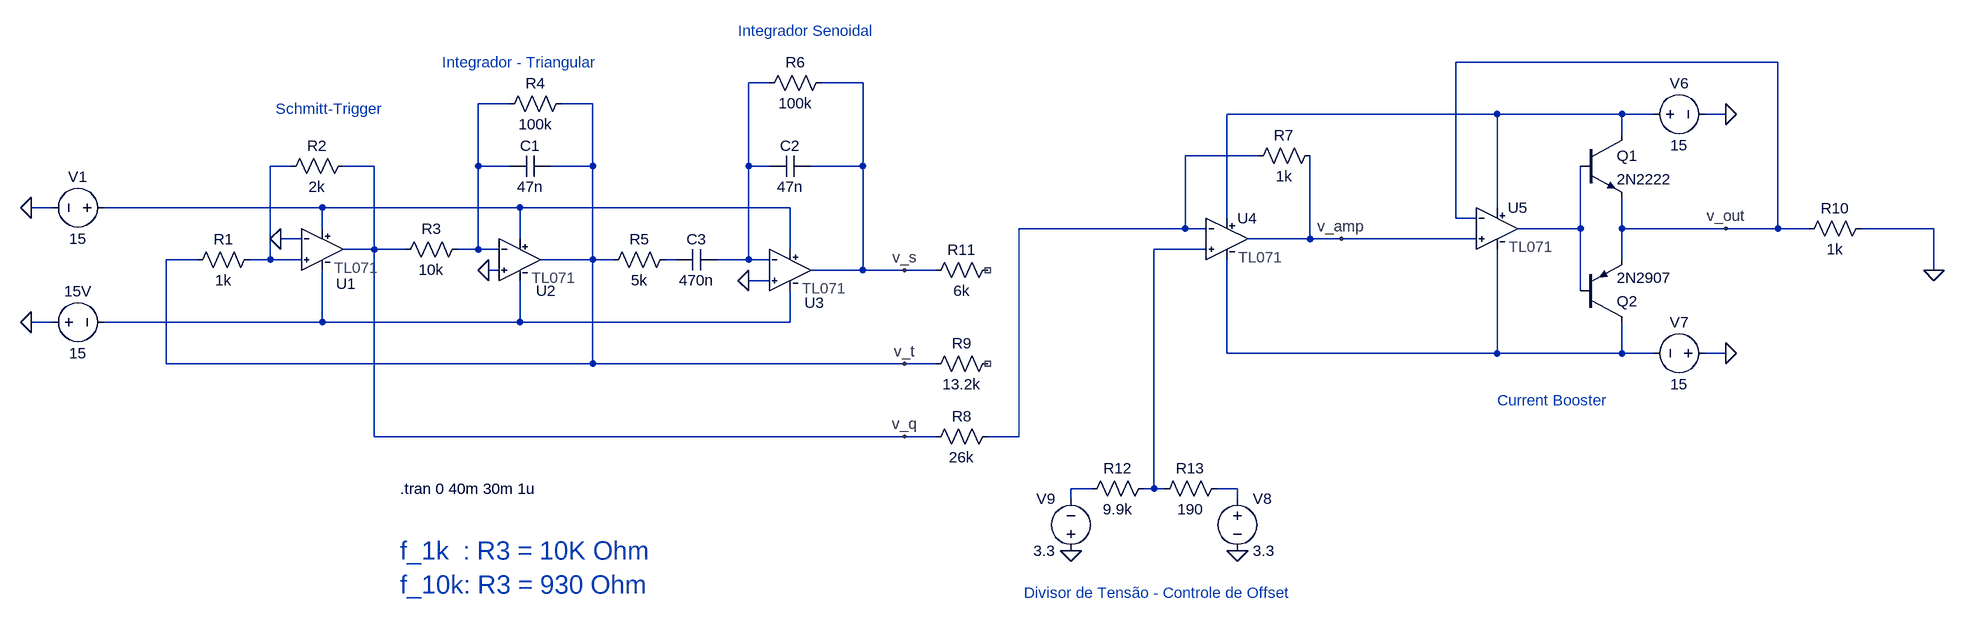
[diagram p0: schematic gerador_de_funcoes.asc]
gerador_de_funcoes.asc, the LTspice schematic file:
Version 4.1
SHEET 1 2532 720
WIRE 2048 -112 1552 -112
WIRE 496 -80 464 -80
WIRE 640 -80 576 -80
WIRE 96 -48 48 -48
WIRE 224 -48 176 -48
WIRE 1616 -32 1200 -32
WIRE 1808 -32 1616 -32
WIRE 1856 -32 1808 -32
WIRE 1968 -32 1936 -32
WIRE 1808 0 1808 -32
WIRE 1248 32 1136 32
WIRE -240 48 -272 48
WIRE -112 48 -160 48
WIRE 48 48 48 -48
WIRE 96 48 48 48
WIRE 224 48 224 -48
WIRE 224 48 160 48
WIRE 464 48 464 -80
WIRE 496 48 464 48
WIRE 640 48 640 -80
WIRE 640 48 560 48
WIRE -608 112 -640 112
WIRE -192 112 -528 112
WIRE 112 112 -192 112
WIRE 528 112 112 112
WIRE 1616 112 1616 -32
WIRE 1200 128 1200 -32
WIRE 1552 128 1552 -112
WIRE 1584 128 1552 128
WIRE -192 144 -192 112
WIRE 1136 144 1136 32
WIRE 1136 144 880 144
WIRE 1168 144 1136 144
WIRE 1744 144 1744 48
WIRE 1744 144 1648 144
WIRE 1808 144 1808 96
WIRE 1968 144 1808 144
WIRE 2048 144 2048 -112
WIRE 2048 144 1968 144
WIRE 2096 144 2048 144
WIRE 2288 144 2176 144
WIRE -224 160 -256 160
WIRE 112 160 112 112
WIRE 1328 160 1328 32
WIRE 1328 160 1232 160
WIRE 1376 160 1328 160
WIRE 1584 160 1376 160
WIRE -112 176 -112 48
WIRE -112 176 -160 176
WIRE -64 176 -112 176
WIRE 48 176 48 48
WIRE 48 176 16 176
WIRE 80 176 48 176
WIRE 528 176 528 112
WIRE 1168 176 1088 176
WIRE -384 192 -432 192
WIRE -272 192 -272 48
WIRE -272 192 -304 192
WIRE -224 192 -272 192
WIRE 224 192 224 48
WIRE 224 192 144 192
WIRE 256 192 224 192
WIRE 352 192 336 192
WIRE 464 192 464 48
WIRE 464 192 416 192
WIRE 496 192 464 192
WIRE 1808 192 1808 144
WIRE 80 208 64 208
WIRE 640 208 640 48
WIRE 640 208 560 208
WIRE 704 208 640 208
WIRE 752 208 704 208
WIRE 2288 208 2288 144
WIRE 496 224 464 224
WIRE 1744 240 1744 144
WIRE -608 288 -640 288
WIRE -192 288 -192 208
WIRE -192 288 -528 288
WIRE 112 288 112 224
WIRE 112 288 -192 288
WIRE 528 288 528 240
WIRE 528 288 112 288
WIRE 1200 336 1200 192
WIRE 1616 336 1616 176
WIRE 1616 336 1200 336
WIRE 1808 336 1808 288
WIRE 1808 336 1616 336
WIRE 1856 336 1808 336
WIRE 1968 336 1936 336
WIRE -432 352 -432 192
WIRE 224 352 224 192
WIRE 224 352 -432 352
WIRE 704 352 224 352
WIRE 752 352 704 352
WIRE -112 464 -112 176
WIRE 704 464 -112 464
WIRE 752 464 704 464
WIRE 880 464 880 144
WIRE 880 464 832 464
WIRE 992 544 960 544
WIRE 1088 544 1088 176
WIRE 1088 544 1072 544
WIRE 1104 544 1088 544
WIRE 1216 544 1184 544
WIRE 960 560 960 544
WIRE 1216 560 1216 544
FLAG -256 160 0
FLAG 464 224 0
FLAG 64 208 0
FLAG -640 288 0
FLAG -640 112 0
FLAG 704 352 v_t
FLAG 704 208 v_s
FLAG 704 464 v_q
FLAG 1376 160 v_amp
FLAG 2288 208 0
FLAG 1216 640 0
FLAG 960 640 0
FLAG 1968 144 v_out
FLAG 1968 336 0
FLAG 1968 -32 0
SYMBOL TL071 -192 176 R0
WINDOW 0 21 53 Left 2
SYMATTR InstName U1
SYMBOL res -144 32 R90
WINDOW 0 0 56 VBottom 2
WINDOW 3 32 56 VTop 2
SYMATTR InstName R2
SYMATTR Value 2k
SYMBOL res 32 160 R90
WINDOW 0 0 56 VBottom 2
WINDOW 3 32 56 VTop 2
SYMATTR InstName R3
SYMATTR Value 10k
SYMBOL res -288 176 R90
WINDOW 0 0 56 VBottom 2
WINDOW 3 32 56 VTop 2
SYMATTR InstName R1
SYMATTR Value 1k
SYMBOL TL071 112 192 R0
WINDOW 0 25 48 Left 2
SYMATTR InstName U2
SYMBOL res 192 -64 R90
WINDOW 0 0 56 VBottom 2
WINDOW 3 32 56 VTop 2
SYMATTR InstName R4
SYMATTR Value 100k
SYMBOL res 352 176 R90
WINDOW 0 0 56 VBottom 2
WINDOW 3 32 56 VTop 2
SYMATTR InstName R5
SYMATTR Value 5k
SYMBOL TL071 528 208 R0
WINDOW 0 22 50 Left 2
SYMATTR InstName U3
SYMBOL cap 560 32 R90
WINDOW 0 0 32 VBottom 2
WINDOW 3 32 32 VTop 2
SYMATTR InstName C2
SYMATTR Value 47n
SYMBOL res 592 -96 R90
WINDOW 0 0 56 VBottom 2
WINDOW 3 32 56 VTop 2
SYMATTR InstName R6
SYMATTR Value 100k
SYMBOL cap 160 32 R90
WINDOW 0 0 32 VBottom 2
WINDOW 3 32 32 VTop 2
SYMATTR InstName C1
SYMATTR Value 47n
SYMBOL voltage -512 112 R90
WINDOW 0 -32 56 VBottom 2
WINDOW 3 32 56 VTop 2
WINDOW 123 0 0 Left 0
WINDOW 39 0 0 Left 0
SYMATTR InstName V1
SYMATTR Value 15
SYMBOL voltage -624 288 R270
WINDOW 0 -32 56 VBottom 2
WINDOW 3 32 56 VTop 2
WINDOW 123 0 0 Left 0
WINDOW 39 0 0 Left 0
SYMATTR InstName 15
SYMATTR Value 15V
SYMBOL TL071 1200 160 R0
SYMATTR InstName U4
SYMBOL TL071 1616 144 R0
SYMATTR InstName U5
SYMBOL npn 1744 0 R0
SYMATTR InstName Q1
SYMATTR Value 2N2222
SYMBOL pnp 1744 288 M180
SYMATTR InstName Q2
SYMATTR Value 2N2907
SYMBOL voltage 1840 -32 R270
WINDOW 0 32 56 VTop 2
WINDOW 3 -32 56 VBottom 2
WINDOW 123 0 0 Left 0
WINDOW 39 0 0 Left 0
SYMATTR InstName V6
SYMATTR Value 15
SYMBOL voltage 1952 336 R90
WINDOW 0 -32 56 VBottom 2
WINDOW 3 32 56 VTop 2
WINDOW 123 0 0 Left 0
WINDOW 39 0 0 Left 0
SYMATTR InstName V7
SYMATTR Value 15
SYMBOL res 2192 128 R90
WINDOW 0 0 56 VBottom 2
WINDOW 3 32 56 VTop 2
SYMATTR InstName R10
SYMATTR Value 1k
SYMBOL res 1088 528 R90
WINDOW 0 0 56 VBottom 2
WINDOW 3 32 56 VTop 2
SYMATTR InstName R12
SYMATTR Value 9.9k
SYMBOL res 1200 528 R90
WINDOW 0 0 56 VBottom 2
WINDOW 3 32 56 VTop 2
SYMATTR InstName R13
SYMATTR Value 190
SYMBOL voltage 1216 544 R0
WINDOW 123 0 0 Left 0
WINDOW 39 0 0 Left 0
SYMATTR InstName V8
SYMATTR Value 3.3
SYMBOL res 1344 16 R90
WINDOW 0 0 56 VBottom 2
WINDOW 3 32 56 VTop 2
SYMATTR InstName R7
SYMATTR Value 1k
SYMBOL voltage 960 656 R180
WINDOW 0 24 96 Left 2
WINDOW 3 24 16 Left 2
WINDOW 123 0 0 Left 0
WINDOW 39 0 0 Left 0
SYMATTR InstName V9
SYMATTR Value 3.3
SYMBOL res 848 448 R90
WINDOW 0 0 56 VBottom 2
WINDOW 3 32 56 VTop 2
SYMATTR InstName R8
SYMATTR Value 26k
SYMBOL res 848 336 R90
WINDOW 0 0 56 VBottom 2
WINDOW 3 32 56 VTop 2
SYMATTR InstName R9
SYMATTR Value 13.2k
SYMBOL res 848 192 R90
WINDOW 0 0 56 VBottom 2
WINDOW 3 32 56 VTop 2
SYMATTR InstName R11
SYMATTR Value 6k
SYMBOL cap 416 176 R90
WINDOW 0 0 32 VBottom 2
WINDOW 3 32 32 VTop 2
SYMATTR InstName C3
SYMATTR Value 470n
TEXT -72 640 Left 4 ;f_1k  : R3 = 10K Ohm\nf_10k: R3 = 930 Ohm
TEXT -72 544 Left 2 !.tran 0 40m 30m 1u
TEXT 888 704 Left 2 ;Divisor de Tensão - Controle de Offset
TEXT 1616 408 Left 2 ;Current Booster
TEXT -264 -40 Left 2 ;Schmitt-Trigger
TEXT -8 -112 Left 2 ;Integrador - Triangular
TEXT 448 -160 Left 2 ;Integrador Senoidal

The netlist it stands for:
* gerador_de_funcoes.asc
X§U1 N005 0 N006 N010 v_q TL071  ; pins In+ In- V+ V- OUT
R2 v_q N005 2k
R3 N002 v_q 10k
R1 N005 v_t 1k
X§U2 0 N002 N006 N010 v_t TL071  ; pins In+ In- V+ V- OUT
R4 v_t N002 100k
R5 N009 v_t 5k
X§U3 0 N001 N006 N010 v_s TL071  ; pins In+ In- V+ V- OUT
C2 v_s N001 47n
R6 v_s N001 100k
C1 v_t N002 47n
V1 N006 0 15
V§15 0 N010 15V
X§U4 N008 N004 N003 N011 v_amp TL071  ; pins In+ In- V+ V- OUT
X§U5 v_amp v_out N003 N011 N007 TL071  ; pins In+ In- V+ V- OUT
Q1 N003 N007 v_out 0 2N2222
Q2 N011 N007 v_out 0 2N2907
V6 N003 0 15
V7 0 N011 15
R10 0 v_out 1k
R12 N008 N012 9.9k
R13 N013 N008 190
V8 N013 0 3.3
R7 v_amp N004 1k
V9 0 N012 3.3
R8 N004 v_q 26k
R9 NC_01 v_t 13.2k
R11 NC_02 v_s 6k
C3 N001 N009 470n
.model NPN NPN
.model PNP PNP
.lib standard.bjt
* f_1k  : R3 = 10K Ohm
* f_10k: R3 = 930 Ohm
.tran 0 40m 30m 1u
* Divisor de Tensão - Controle de Offset
* Current Booster
* Schmitt-Trigger
* Integrador - Triangular
* Integrador Senoidal
.lib TL071.lib
.backanno
.end